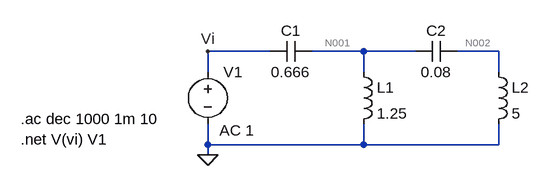
[diagram p0: schematic cauer_o.asc]
cauer_o.asc, the LTspice schematic file:
Version 4
SHEET 1 880 680
WIRE 48 80 -48 80
WIRE 192 80 112 80
WIRE 272 80 192 80
WIRE 400 80 336 80
WIRE -48 112 -48 80
WIRE 192 112 192 80
WIRE 400 112 400 80
WIRE -48 224 -48 192
WIRE 192 224 192 192
WIRE 192 224 -48 224
WIRE 400 224 400 192
WIRE 400 224 192 224
WIRE -48 240 -48 224
FLAG -48 240 0
FLAG -48 80 Vi
SYMBOL cap 112 64 R90
WINDOW 0 0 32 VBottom 2
WINDOW 3 32 32 VTop 2
SYMATTR InstName C1
SYMATTR Value 0.666
SYMBOL cap 336 64 R90
WINDOW 0 0 32 VBottom 2
WINDOW 3 32 32 VTop 2
SYMATTR InstName C2
SYMATTR Value 0.08
SYMBOL ind 176 96 R0
SYMATTR InstName L1
SYMATTR Value 1.25
SYMATTR SpiceLine Rser=0
SYMBOL ind 384 96 R0
SYMATTR InstName L2
SYMATTR Value 5
SYMATTR SpiceLine Rser=0
SYMBOL voltage -48 96 R0
WINDOW 123 18 106 Left 2
WINDOW 39 0 0 Left 0
SYMATTR InstName V1
SYMATTR Value ""
SYMATTR Value2 AC 1
TEXT -336 184 Left 2 !.ac dec 1000 1m 10
TEXT -336 216 Left 2 !.net V(vi) V1

The netlist it stands for:
* cauer_o.asc
C1 N001 Vi 0.666
C2 N002 N001 0.08
L1 N001 0 1.25 Rser=0
L2 N002 0 5 Rser=0
V1 Vi 0 AC 1
.ac dec 1000 1m 10
.net V(vi) V1
.backanno
.end

* Results of the author's LTspice run, read from the files saved beside the schematic
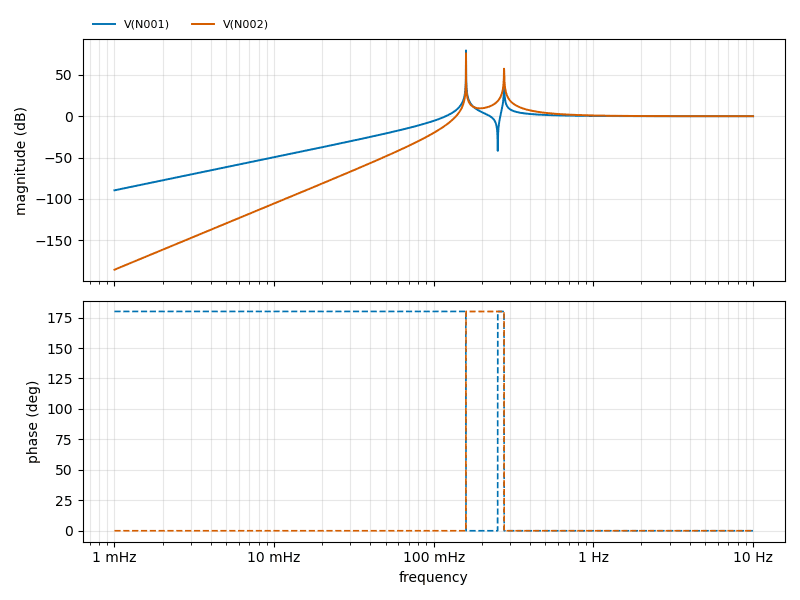
[diagram p1: AC Analysis of cauer_o.asc, plotted from the saved traces]
* AC Analysis, 1 run:
*   V(N001): -89.66 dB at 1 mHz, 0.00 dB at 10 Hz, peak 79.64 dB at 159.2 mHz, 3 dB below the peak at 159.2 mHz and 159.3 mHz
*   V(N002): -185.70 dB at 1 mHz, 0.01 dB at 10 Hz, peak 76.13 dB at 159.2 mHz, 3 dB below the peak at 159.2 mHz and 159.3 mHz